# EAGLE design RGB LED Driver (EAGLE 9.3.2)
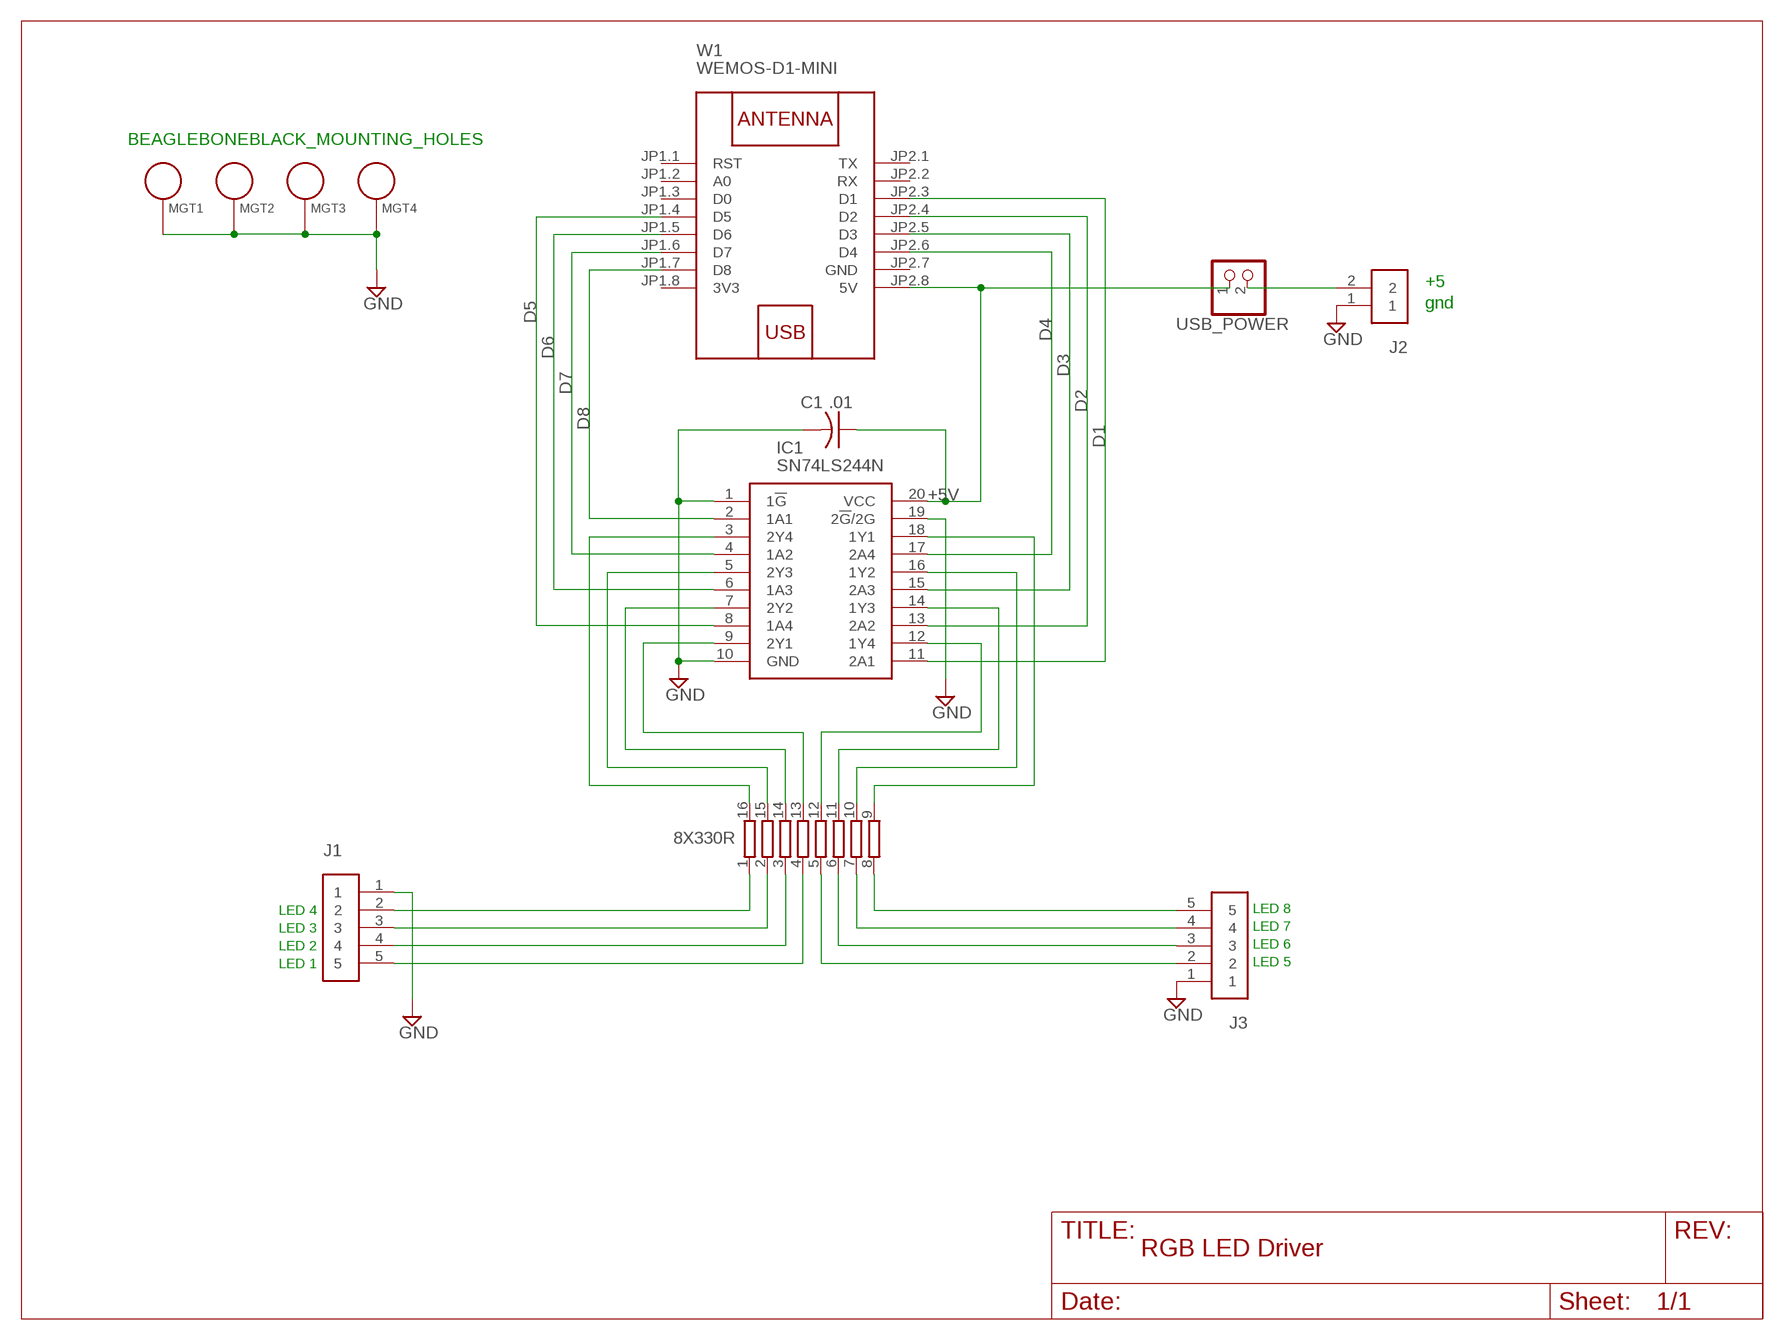
[diagram p0: schematic, sheet 1]

## Parts
8X330R  2NBS16-8  [SO16]
C1  .01  C-US050-024X044  [C050-024X044]
IC1  SN74LS244N  [DIP794W53P254L2540H508Q20N]
J1  691311400105  [TERMINALBLOCK_PLUGGABLE-5-7.62MM]
J2  691311400102  [TERMINALBLOCK_PLUGGABLE-2-7.62MM]
J3  691311400105  [TERMINALBLOCK_PLUGGABLE-5-7.62MM]
MGT1  BEAGLEBONEBLACK_MOUNTING_HOLE  [BEAGLEBONEBLACK_MOUNTING_HOLE]
MGT2  BEAGLEBONEBLACK_MOUNTING_HOLE  [BEAGLEBONEBLACK_MOUNTING_HOLE]
MGT3  BEAGLEBONEBLACK_MOUNTING_HOLE  [BEAGLEBONEBLACK_MOUNTING_HOLE]
MGT4  BEAGLEBONEBLACK_MOUNTING_HOLE  [BEAGLEBONEBLACK_MOUNTING_HOLE]
USB_POWER  PINHD-1X2  [1X02]
W1  WEMOS-D1-MINI  [WEMOS-D1-MINI]

## Nets
+5V: C1.1 IC1.20(VCC) USB_POWER.1 W1.JP2.8(5V)
D1: IC1.11(2A1) W1.JP2.3(D1)
D2: IC1.13(2A2) W1.JP2.4(D2)
D3: IC1.15(2A3) W1.JP2.5(D3)
D4: IC1.17(2A4) W1.JP2.6(D4)
D5: IC1.8(1A4) W1.JP1.4(D5)
D6: IC1.6(1A3) W1.JP1.5(D6)
D7: IC1.4(1A2) W1.JP1.6(D7)
D8: IC1.2(1A1) W1.JP1.7(D8)
GND: C1.2 IC1.1(1!G) IC1.10(GND) IC1.19(2!G!/2G) J1.1 J2.1 J3.1 MGT1.P$1 MGT2.P$1 MGT3.P$1 MGT4.P$1
N$1: 8X330R.12 IC1.12(1Y4)
N$2: 8X330R.11 IC1.14(1Y3)
N$3: 8X330R.10 IC1.16(1Y2)
N$4: 8X330R.9 IC1.18(1Y1)
N$5: 8X330R.8 J3.5
N$6: 8X330R.7 J3.4
N$7: 8X330R.6 J3.3
N$8: 8X330R.14 IC1.7(2Y2)
N$9: 8X330R.13 IC1.9(2Y1)
N$10: 8X330R.5 J3.2
N$11: 8X330R.15 IC1.5(2Y3)
N$12: 8X330R.16 IC1.3(2Y4)
N$13: J2.2 USB_POWER.2
N$15: 8X330R.4 J1.5
N$16: 8X330R.3 J1.4
N$19: 8X330R.2 J1.3
N$20: 8X330R.1 J1.2
Unconnected: W1.JP1.1(RST) W1.JP1.2(A0) W1.JP1.3(D0) W1.JP2.1(TX) W1.JP2.2(RX)

## Notes on the sheet
- BEAGLEBONEBLACK_MOUNTING_HOLES
- +5
- gnd
- LED 4 | LED 8
- LED 3 | LED 7
- LED 2 | LED 6
- LED 1 | LED 5

## Power pins joined to a net without a drawn wire
3V3: W1.JP1.8(3V3)
GND: W1.JP2.7(GND)

## Library data of the parts
8X330R = resistor-bourns:2NBS16-8: BOURNS RESISTOR NETWORK; OC_FARNELL: unknown; OC_NEWARK: unknown
C1 = rcl:C-US: CAPACITOR, American symbol; SPICEPREFIX: C
IC1 = SamacSys_Parts:SN74LS244N: Buffers, Drivers, Receivers, Transceivers DIP-20 RoHS Source: Datasheet <https://www.ti.com/lit/gpn/SN74LS244>; DESCRIPTION: Buffers, Drivers, Receivers, Transceivers DIP-20 RoHS; HEIGHT: 5.08mm; MANUFACTURER_NAME: Texas Instruments; MANUFACTURER_PART_NUMBER: SN74LS244N; MOUSER_PART_NUMBER: 595-SN74LS244N; MOUSER_PRICE-STOCK: https://www.mouser.com/Search/Refine.aspx?Keyword=595-SN74LS244N
J1 J3 = Terminal Blocks:691311400105: 7.62MM CLOSE VERTICAL PCB HEADER WR-TBL Manufacturer's datasheet <https://katalog.we-online.com/em/datasheet/6913114001xx.pdf>; CREATED_BY: PCBLayout.com; DIGIKEY_PART_NO: 732-2826-ND; MANUFACTURER: WURTH ELEKTRONIK; MPN: 691311400105
J2 = Terminal Blocks:691311400102: 7.62MM CLOSE VERTICAL PCB HEADER WR-TBL Manufacturer's datasheet <https://katalog.we-online.com/em/datasheet/6913114001xx.pdf>; CREATED_BY: PCBLayout.com; DIGIKEY_PART_NO: 732-2823-ND; MANUFACTURER: WURTH ELEKTRONIK; MPN: 691311400102
MGT1-MGT4 = BeagleBone_Black_Wireless:BEAGLEBONEBLACK_MOUNTING_HOLE: Chassis Mounting Hole w/GND connection ability
USB_POWER = pinhead:PINHD-1X2: PIN HEADER
W1 = diy-modules:WEMOS-D1-MINI: WEMOS D1 mini: Mini Wi-Fi Board based on ESP-8266 device More details can be found here: https://www.wemos.cc/product/d1-mini.html Click here to find device on ebay.com <http://www.ebay.com/sch/wemos+d1+mini+nodemcu>

## Board
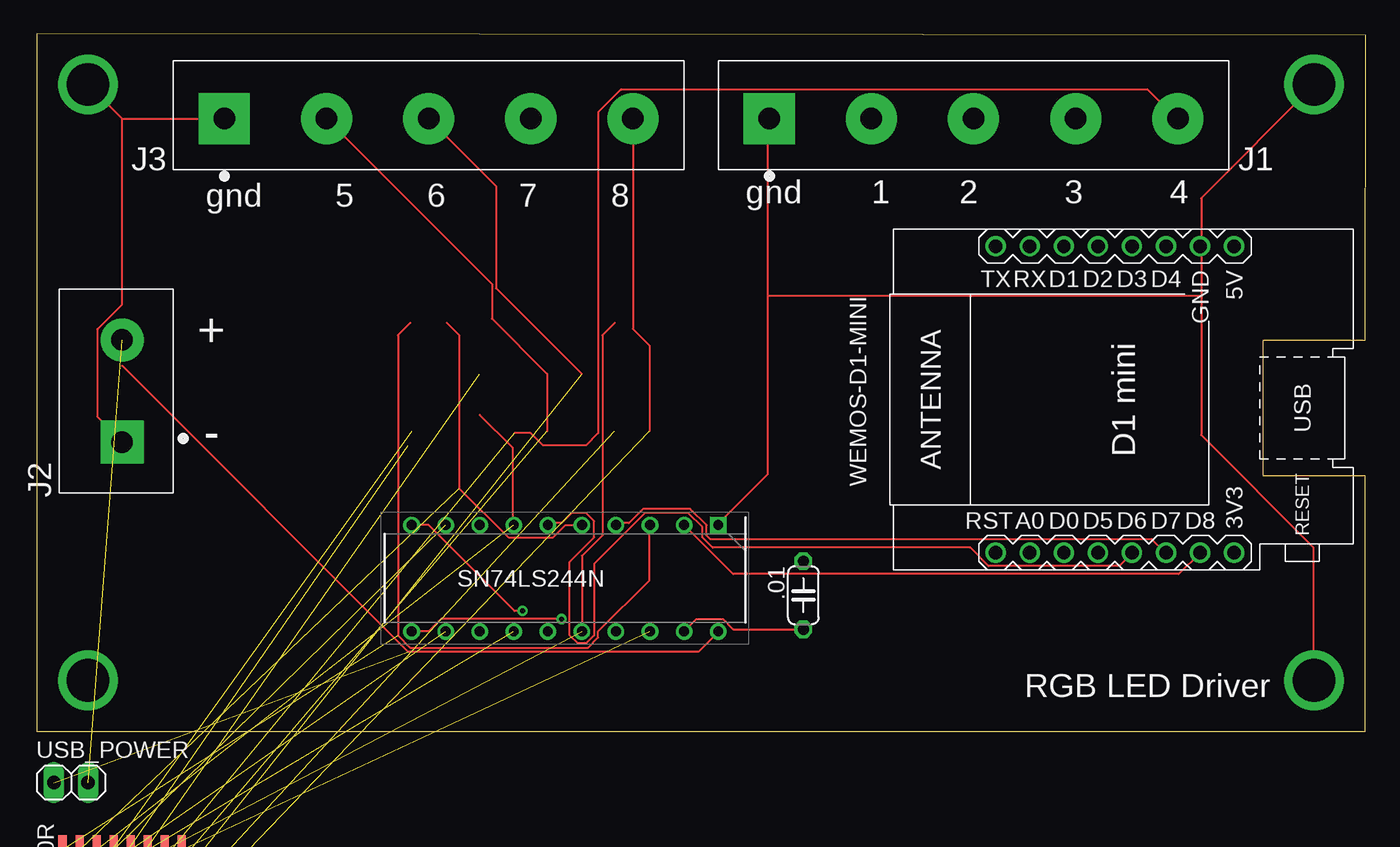
[diagram p1: board, top side]
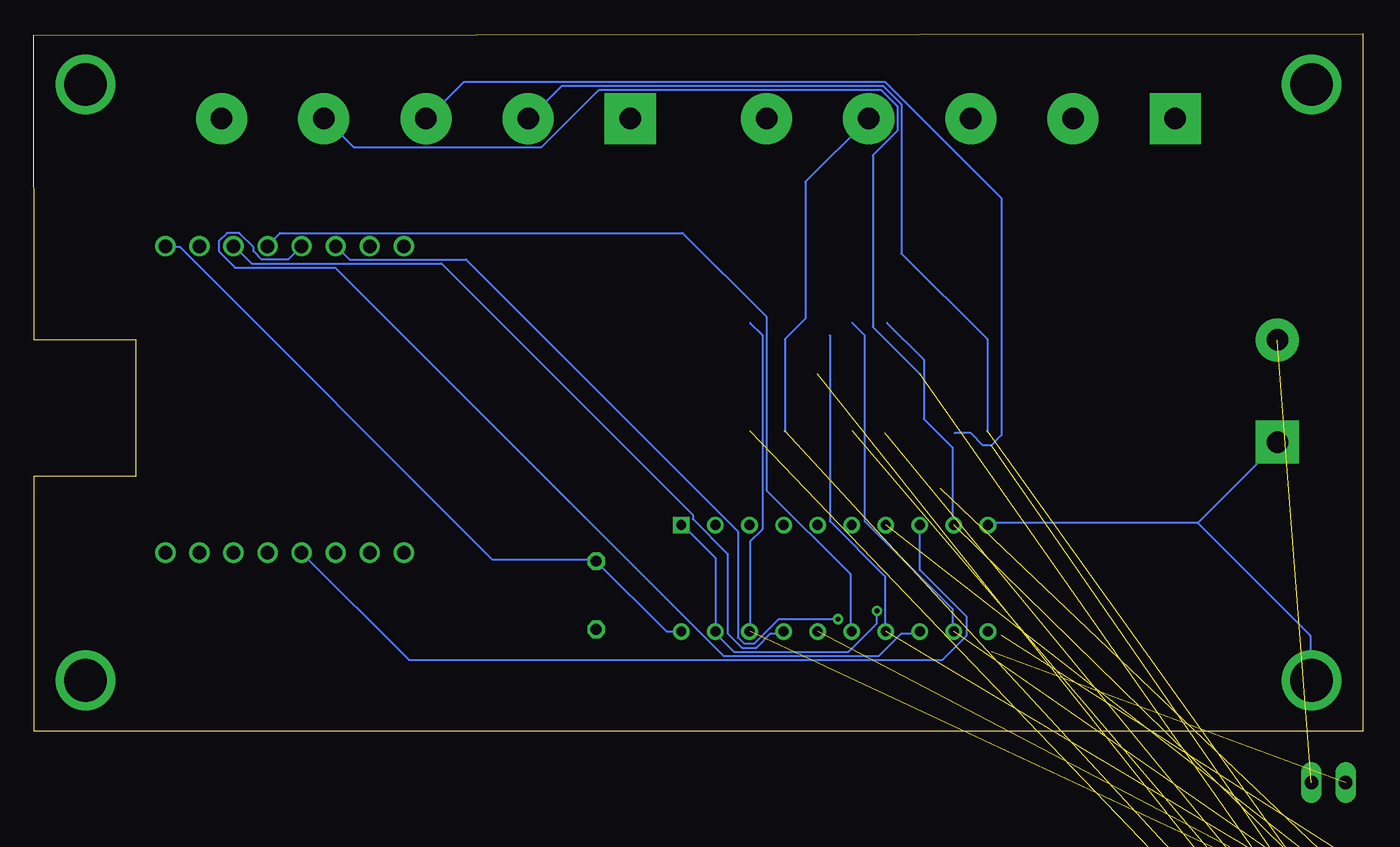
[diagram p2: board, bottom side, seen from below]

Size 99.11 x 52.06 mm. Coordinates in mm from the lower left corner, seen from the top.
Outline: 0,0 99.06,0 99.06,19.05 91.44,19.05 91.44,29.21 99.06,29.21 99.11,51.93 0,52.06 0,0
Copper layers (1*16): Top 0.035mm / dielectric 1.5mm / Bottom 0.035mm
Design rules "default": minimum track width 6mil, minimum drill 0.35mm, track to track 6mil, track to pad 6mil, pad to pad 6mil, via to via 6mil, smd to smd 6mil, copper to edge 40mil, drill to drill 6mil, minimum pad ring 10mil, minimum via ring 8mil, stop-mask expansion 4mil, vias tented up to drill 0mil, thermal gap 10mil

### Footprints (pad centres in the part's own frame; a part is rotated, then mirrored left to right if it is on the bottom)
SO16 = smd 0.6 x 2.2: 1 -4.445,-2.6; 2 -3.175,-2.6; 3 -1.905,-2.6; 4 -0.635,-2.6; 5 0.635,-2.6; 6 1.905,-2.6; 7 3.175,-2.6; 8 4.445,-2.6; 9 4.445,2.6; 10 3.175,2.6; 11 1.905,2.6; 12 0.635,2.6; 13 -0.635,2.6; 14 -1.905,2.6; 15 -3.175,2.6; 16 -4.445,2.6
C050-024X044 = drill 0.813 octagon: 1 -2.54,0; 2 2.54,0
DIP794W53P254L2540H508Q20N = drill 0.73 pad 1.13 square: 1 -3.97,11.43 | drill 0.73 pad 1.13: 2 -3.97,8.89; 3 -3.97,6.35; 4 -3.97,3.81; 5 -3.97,1.27; 6 -3.97,-1.27; 7 -3.97,-3.81; 8 -3.97,-6.35; 9 -3.97,-8.89; 10 -3.97,-11.43; 11 3.97,-11.43; 12 3.97,-8.89; 13 3.97,-6.35; 14 3.97,-3.81; 15 3.97,-1.27; 16 3.97,1.27; 17 3.97,3.81; 18 3.97,6.35; 19 3.97,8.89; 20 3.97,11.43
TERMINALBLOCK_PLUGGABLE-5-7.62MM = drill 1.6 pad 3.81 square: 1 -15.24,0 | drill 1.6 pad 3.81: 2 -7.62,0; 3 0,0; 4 7.62,0; 5 15.24,0
TERMINALBLOCK_PLUGGABLE-2-7.62MM = drill 1.6 pad 3.2 square: 1 -3.81,0 | drill 1.6 pad 3.2: 2 3.81,0
BEAGLEBONEBLACK_MOUNTING_HOLE = drill 3.175 pad 4.445: P$1 0,0
1X02 = drill 1.016 long: 1 -1.27,0; 2 1.27,0
WEMOS-D1-MINI = drill 1: JP1.1 -11.43,9.525; JP1.2 -11.43,6.985; JP1.3 -11.43,4.445; JP1.4 -11.43,1.905; JP1.5 -11.43,-0.635; JP1.6 -11.43,-3.175; JP1.7 -11.43,-5.715; JP1.8 -11.43,-8.255; JP2.1 11.43,9.525; JP2.2 11.43,6.985; JP2.3 11.43,4.445; JP2.4 11.43,1.905; JP2.5 11.43,-0.635; JP2.6 11.43,-3.175; JP2.7 11.43,-5.715; JP2.8 11.43,-8.255

### Placement (x,y rotation side)
8X330R  6.35,-11.43 0 top  (outside the outline)
C1  57.15,10.16 270 top
IC1  39.37,11.43 270 top
J1  69.85,45.72 0 top
J2  6.35,25.4 90 top
J3  29.21,45.72 0 top
MGT1  3.81,48.26 0 top
MGT2  3.81,3.81 0 top
MGT3  95.25,3.81 0 top
MGT4  95.25,48.26 0 top
USB_POWER  2.54,-3.81 0 top  (outside the outline)
W1  81.03,24.76 90 top

### Tracks (layer width: path | path; a pad name or v marks a point on that pad's centre or on a via)
+5V  (1 unrouted)
  Top 0.152: 6.35,27.28 27.69,5.94 49.33,5.94 50.7,7.31 IC1.20
  Bottom 0.152: IC1.20 50.85,7.47 51.92,7.47 C1.1 57.25,12.8 64.87,12.8 88.19,36.12 89.26,36.12 W1.JP2.8
D1  (via drill 0.35)
  Top 0.152: v39.12,8.38 30.12,8.38 29.21,7.47 27.99,7.47 IC1.11
  Bottom 0.152: v39.12,8.38 43.54,8.38 45.36,6.55 46.13,6.55 46.58,7.01 46.58,14.93 66.85,35.2 75.54,35.2 76.45,36.12 W1.JP2.3
D2
  Bottom 0.152: W1.JP2.4 80.11,35.2 82.09,35.2 82.7,35.81 82.7,36.12 83.77,37.19 84.68,37.19 85.29,36.58 85.29,35.81 84.07,34.59 76.61,34.59 47.65,5.64 36.07,5.64 34.39,7.31 33.02,7.31 IC1.13
D3
  Bottom 0.152: IC1.15 38.2,7.47 38.2,11.73 44.45,17.98 44.45,30.94 50.7,37.19 80.72,37.19 81.64,36.27 W1.JP2.5
D4
  Bottom 0.152: IC1.17 43.23,7.31 44.15,7.31 45.21,6.25 46.28,6.25 47.35,7.31 47.35,13.26 49.94,15.85 49.94,16.15 68.68,34.9 82.86,34.9 84.07,36.12 W1.JP2.6
D5
  Bottom 0.152: IC1.8 33.02,12.04 29.52,8.53 29.52,7.16 31.34,5.33 71.12,5.33 W1.JP1.4
D6
  Top 0.152: IC1.6 38.2,15.54 39.12,15.54 39.88,16.31 40.95,16.31 41.55,15.7 41.55,14.48 39.73,12.65 39.73,7.16 40.34,6.55 40.95,6.55 41.55,7.16 41.55,12.5 45.36,16.31 48.57,16.31 49.63,15.24 49.63,14.48 50.39,13.72 69.6,13.72 70.97,12.34 80.72,12.34 81.64,13.26 W1.JP1.5
D7
  Top 0.152: IC1.4 43.23,15.54 44.15,15.54 45.21,16.61 48.72,16.61 49.94,15.39 49.94,14.63 50.24,14.33 83.16,14.33 84.07,13.41 W1.JP1.6
D8
  Top 0.152: W1.JP1.7 85.14,11.73 51.92,11.73 IC1.2
GND  (via drill 0.35)
  Top 0.152: 6.35,45.72 J3.1 | MGT1.P$1 6.35,45.72 | 6.35,45.72 6.35,31.85 4.52,30.02 4.52,23.47 6.35,21.64 J2.1 | C1.2 51.92,7.62 51.16,8.38 49.17,8.38 IC1.19 | 54.51,32.46 54.51,19.2 50.85,15.54 IC1.1 | 54.51,32.46 54.51,45.72 J1.1 | MGT4.P$1 95.2,48.16 86.82,39.78 86.82,36.27 W1.JP2.7 86.82,36.12 86.82,32.46 | 86.82,32.46 86.82,22.1 95.2,13.72 95.2,3.81 MGT3.P$1 | 86.82,32.46 54.51,32.46 | v36.22,8.99 35.61,8.99 29.21,15.39 27.99,15.39 IC1.10
  Bottom 0.152: 12.29,15.54 27.84,15.54 IC1.10 | 12.29,15.54 6.35,21.49 J2.1 | 12.29,15.54 3.91,7.16 3.91,3.81 MGT2.P$1 | IC1.1 50.7,15.39 48.26,12.95 IC1.19 48.26,7.31 46.89,5.94 38.35,5.94 36.22,8.08 v36.22,8.99
N$1  (1 unrouted)
  Bottom 0.152: 38.05,30.48 37.14,29.57 37.14,15.7 30.58,9.14 30.58,7.47 IC1.12
N$2  (1 unrouted)
  Bottom 0.152: 39.73,29.57 39.73,15.7 35.61,11.58 35.61,7.47 IC1.14
N$3  (1 unrouted)
  Top 0.152: IC1.16 40.64,13.11 42.16,14.63 42.16,29.57 43.08,30.48
N$4  (1 unrouted)
  Bottom 0.152: 45.67,30.48 44.76,29.57 44.76,15.09 45.67,14.17 45.67,7.47 IC1.18
N$5  (1 unrouted)
  Top 0.152: 45.67,22.4 45.67,28.8 44.45,30.02 J3.5
N$6  (1 unrouted)
  Bottom 0.152: 43.08,22.4 43.08,29.26 41.55,30.79 41.55,41 J3.4
N$7  (1 unrouted)
  Top 0.152: 40.64,26.67 34.24,33.07 34.24,40.69 J3.3
N$8  (1 unrouted)
  Top 0.152: 33.02,23.62 35.46,21.18 35.46,15.54 IC1.7
N$9  (1 unrouted)
  Bottom 0.152: 35.46,30.48 32.72,27.74 32.72,23.32 30.58,21.18 30.58,15.54 IC1.9
N$10  (1 unrouted)
  Top 0.152: 38.05,22.4 38.05,26.67 33.93,30.79 33.93,33.38 J3.2
N$11  (1 unrouted)
  Top 0.152: 30.58,30.48 31.5,29.57 31.5,18.14 35.15,14.48 38.51,14.48 39.42,15.39 IC1.5
N$12  (1 unrouted)
  Top 0.152: 27.84,30.48 26.92,29.57 26.92,7.16 27.84,6.25 41.1,6.25 41.86,7.01 41.86,7.47 45.67,11.28 45.67,15.39 IC1.3
N$13  (1 unrouted)
N$15  (1 unrouted)
  Top 0.152: 35.61,22.25 36.83,22.25 37.74,21.34 40.95,21.34 41.86,22.25 41.86,46.18 43.54,47.85 82.86,47.85 84.99,45.72 J1.5
N$16  (1 unrouted)
  Bottom 0.152: 33.02,26.67 36.52,30.18 36.52,42.98 34.7,44.81 34.7,46.63 35.92,47.85 56.95,47.85 61.21,43.59 75.23,43.59 77.37,45.72 J1.4
N$19  (1 unrouted)
  Bottom 0.152: 30.43,22.25 29.21,22.25 28.3,21.34 27.69,21.34 26.92,22.1 26.92,39.78 35.61,48.46 67,48.46 69.75,45.72 J1.3
N$20  (1 unrouted)
  Bottom 0.152: 27.99,22.4 27.99,29.26 34.39,35.66 34.39,46.79 35.76,48.16 59.69,48.16 62.13,45.72 J1.2

### Text on the board
tNames: gnd | 5 | 6 | 7 | 8 | gnd | 1 | 2 | 3 | 4 | + | - | RGB LED Driver